# Altium schematic sheet Thermistor Channel.SchDoc
size A
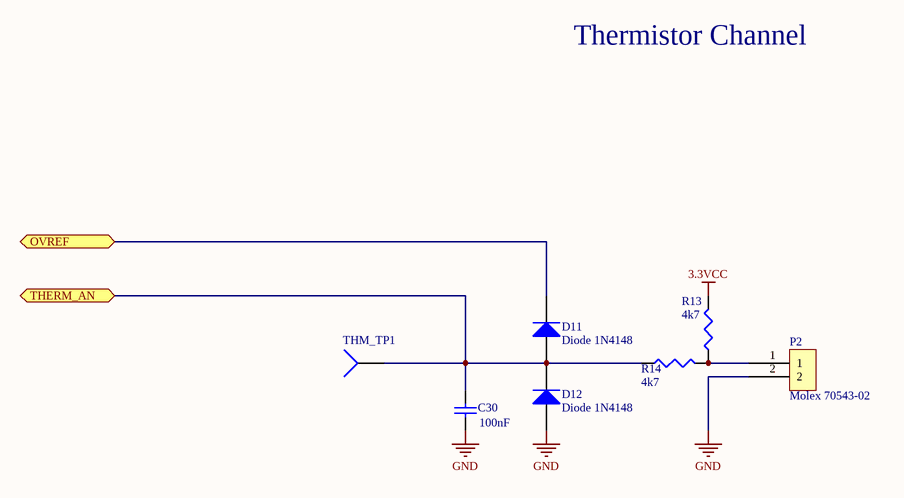
[diagram p0: Thermistor Channel.SchDoc]

## Parts
C30  value 100nF  [1608[0603]]  (hidden comment: Cap Semi)
D11  Diode 1N4148  [1N4148WT]
D12  Diode 1N4148  [1N4148WT]
P2  Molex 70543-02  [70543-02]
R13  value 4k7  [J1-0603]  (hidden comment: Res3)
R14  value 4k7  [J1-0603]  (hidden comment: Res3)
THM_TP1  TP4  [PIN1]  (value not drawn)

## Ports
OVREF, THERM_AN

## Nets
3.3VCC: R13.2
GND: C30.1 D12.1(A) P2.2
OVREF: D11.2(K) ; port OVREF
THERM_AN: C30.2 D11.1(A) D12.2(K) R14.1 THM_TP1.1 ; port THERM_AN
NetP2_1: P2.1 R13.1 R14.2

## Notes on the sheet
- Thermistor Channel

## Library data of the parts
C30 = Cap Semi: Capacitor (Semiconductor SIM Model); Published: 8-Jun-2000; LatestRevisionDate: 29-May-2009; LatestRevisionNote: IPC-7351 Footprint Added.; PackageReference: C1206; Publisher: Altium Limited; PackageDescription: Chip Capacitor
D11 D12 = Diode 1N4148: High Conductance Fast Diode; Published: 8-Jun-2000; LatestRevisionDate: 17-Jul-2002; LatestRevisionNote: Re-released for DXP Platform.; DatasheetVersion: 1997; PackageReference: DO-35; Publisher: Altium Limited; PackageDescription: Diode, Axial; Body 3.8 x 1.9 mm (LxDia. max), Lead Dia. 0.53 mm (max); Code_JEDEC: DO-204-AH; ComponentLink1Description: Manufacturer Link; ComponentLink1URL: http://www.fairchildsemi.com/; ComponentLink2Description: Datasheet; ComponentLink2URL: http://www.fairchildsemi.com/ds/1N%2F1N4148.pdf
R13 R14 = Res3: Resistor; Published: 8-Jun-2000; LatestRevisionDate: 29-May-2009; LatestRevisionNote: IPC-7351 Footprint Added.; PackageReference: J1-0603; Publisher: Altium Limited; PackageDescription: Chip Resistor
THM_TP1 = Socket: LatestRevisionDate: 17-Jul-2002; LatestRevisionNote: Re-released for DXP Platform.; Publisher: Altium Limited